# Altium schematic sheet IDC_connectors.SchDoc: IDC
size 420 x 297 mm; Author: G.K.; CompanyName: WUT; DrawnBy: G.K.; Organization: CERN; Address1: Warsaw Univeristy of Technology; Address2: Nowowiejska 15/19; DocumentNumber: 7; Revision: -; SheetNumber: 7; SheetTotal: 10; EDA_Number: ARTIQ; Projet: Banker; ModifiedBy: -; CreateDate: XX/XX/XXXX; CheckedDate: -; Title2: Connector & driver; DivGrp: ISE; Designer: G.K.; ModifiedDate: -; ProjectName: ADC/DAC MEZZANINE
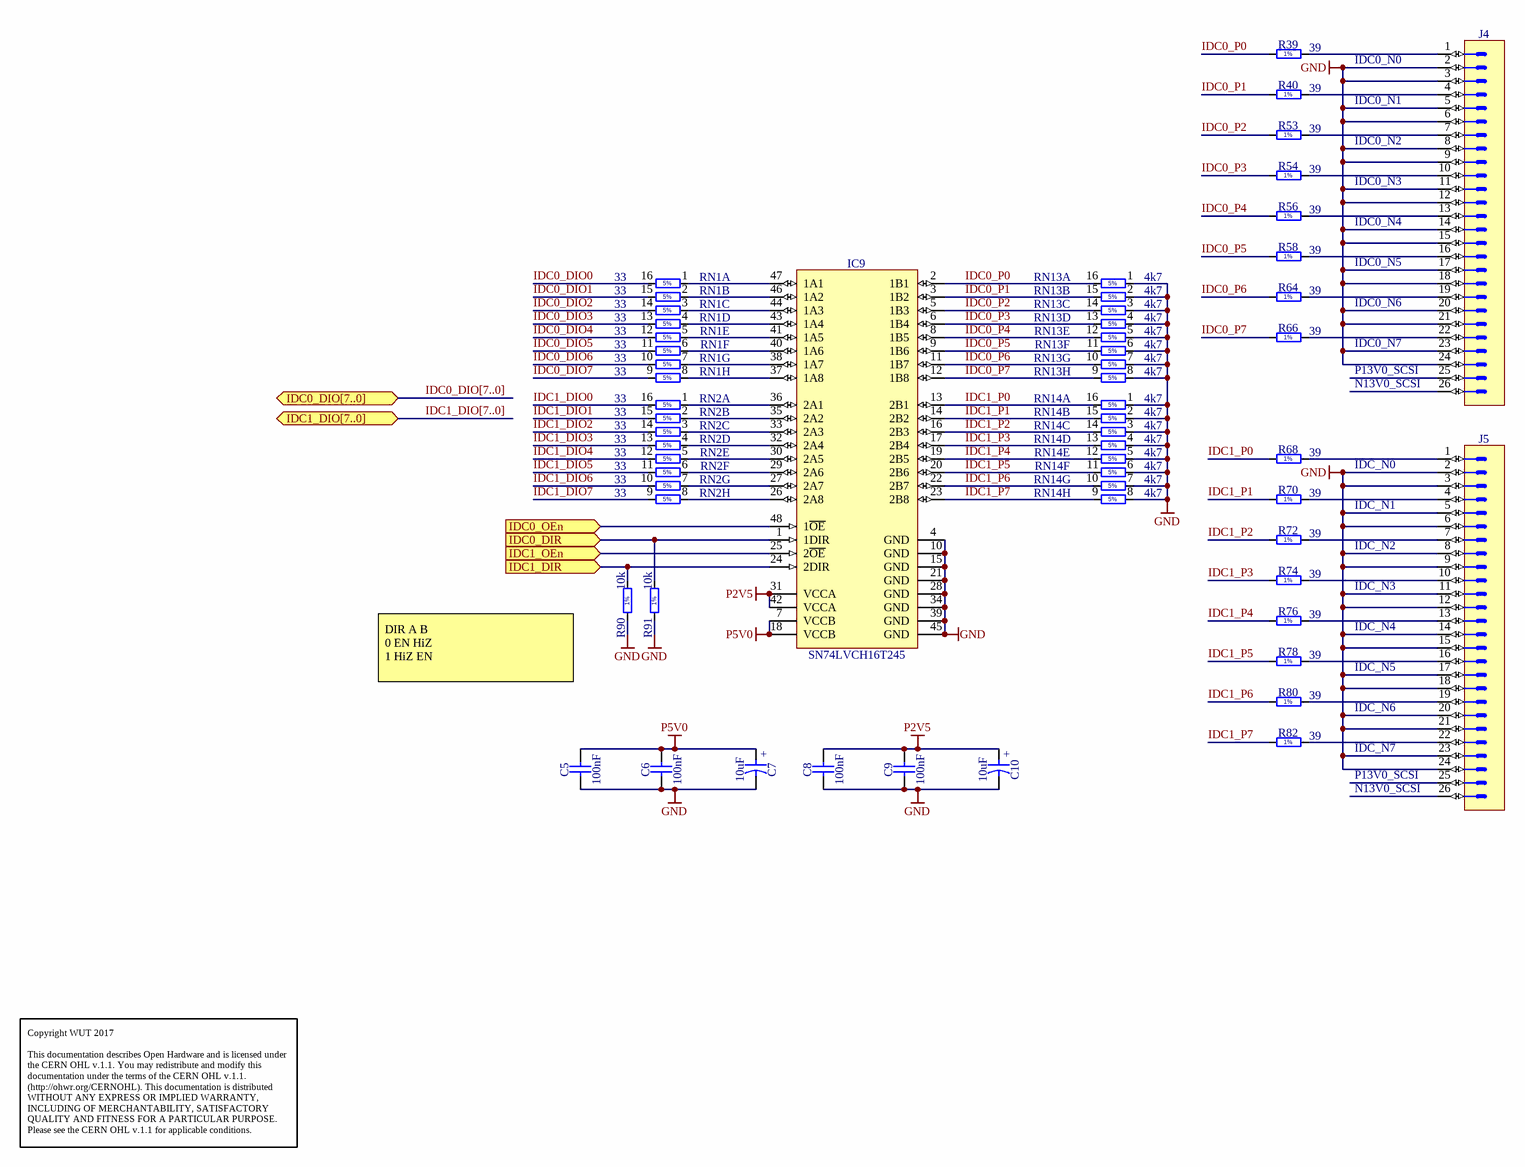
[diagram p0: IDC_connectors.SchDoc]

## Parts
C5  100nF  [CAPC1005X55N]
C6  100nF  [CAPC1005X55N]
C7  10uF  [CAPAE430X540N]
C8  100nF  [CAPC1005X55N]
C9  100nF  [CAPC1005X55N]
C10  10uF  [CAPAE430X540N]
IC9  SN74LVCH16T245  [SOP50P810X120-48N]
J4  Header 26  [3M_N2526-6003RB]  (value not drawn)
J5  Header 26  [3M_N2526-6003RB]  (value not drawn)
R39  39  [RESC2012X60N]
R40  39  [RESC2012X60N]
R53  39  [RESC2012X60N]
R54  39  [RESC2012X60N]
R56  39  [RESC2012X60N]
R58  39  [RESC2012X60N]
R64  39  [RESC2012X60N]
R66  39  [RESC2012X60N]
R68  39  [RESC2012X60N]
R70  39  [RESC2012X60N]
R72  39  [RESC2012X60N]
R74  39  [RESC2012X60N]
R76  39  [RESC2012X60N]
R78  39  [RESC2012X60N]
R80  39  [RESC2012X60N]
R82  39  [RESC2012X60N]
R90  10k  [RESC1005X40N]
R91  10k  [RESC1005X40N]
RN1  33  [RN_YAGEO_YC248]  (parts A,B,C,D,E,F,G,H of 8)
RN2  33  [RN_YAGEO_YC248]  (parts A,B,C,D,E,F,G,H of 8)
RN13  4k7  [RN_YAGEO_YC248]  (parts A,B,C,D,E,F,G,H of 8)
RN14  4k7  [RN_YAGEO_YC248]  (parts A,B,C,D,E,F,G,H of 8)

## Ports
IDC0_DIO[7..0] (bidir), IDC0_DIR (in), IDC0_OEn (in), IDC1_DIO[7..0] (bidir), IDC1_DIR (in), IDC1_OEn (in)

## Nets
GND: C5.1 C6.1 C7.2 C8.1 C9.1 C10.2 IC9.4(GND) IC9.10(GND) IC9.15(GND) IC9.21(GND) IC9.28(GND) IC9.34(GND) IC9.39(GND) IC9.45(GND) J4.2 J4.3 J4.5 J4.6 J4.8 J4.9 J4.11 J4.12 J4.14 J4.15 J4.17 J4.18 J4.20 J4.21 J4.23 J4.24 J5.2 J5.3 J5.5 J5.6 J5.8 J5.9 J5.11 J5.12 J5.14 J5.15 J5.17 J5.18 J5.20 J5.21 J5.23 J5.24 R90.1 R91.1 RN13.1 RN13.2 RN13.3 RN13.4 RN13.5 RN13.6 RN13.7 RN13.8 RN14.1 RN14.2 RN14.3 RN14.4 RN14.5 RN14.6 RN14.7 RN14.8
P2V5: C8.2 C9.2 C10.1 IC9.31(VCCA) IC9.42(VCCA)
P5V0: C5.2 C6.2 C7.1 IC9.7(VCCB) IC9.18(VCCB)
IDC0_DIO0: RN1.16
IDC0_DIO1: RN1.15
IDC0_DIO2: RN1.14
IDC0_DIO3: RN1.13
IDC0_DIO4: RN1.12
IDC0_DIO5: RN1.11
IDC0_DIO6: RN1.10
IDC0_DIO7: RN1.9
IDC0_DIR: IC9.1(1DIR) R91.2 ; port IDC0_DIR
IDC0_OEn: IC9.48(1~{OE}) ; port IDC0_OEn
IDC0_P0: IC9.2(1B1) R39.1 RN13.16
IDC0_P1: IC9.3(1B2) R40.1 RN13.15
IDC0_P2: IC9.5(1B3) R53.1 RN13.14
IDC0_P3: IC9.6(1B4) R54.1 RN13.13
IDC0_P4: IC9.8(1B5) R56.1 RN13.12
IDC0_P5: IC9.9(1B6) R58.1 RN13.11
IDC0_P6: IC9.11(1B7) R64.1 RN13.10
IDC0_P7: IC9.12(1B8) R66.1 RN13.9
IDC1_DIO0: RN2.16
IDC1_DIO1: RN2.15
IDC1_DIO2: RN2.14
IDC1_DIO3: RN2.13
IDC1_DIO4: RN2.12
IDC1_DIO5: RN2.11
IDC1_DIO6: RN2.10
IDC1_DIO7: RN2.9
IDC1_DIR: IC9.24(2DIR) R90.2 ; port IDC1_DIR
IDC1_OEn: IC9.25(2~{OE}) ; port IDC1_OEn
IDC1_P0: IC9.13(2B1) R68.1 RN14.16
IDC1_P1: IC9.14(2B2) R70.1 RN14.15
IDC1_P2: IC9.16(2B3) R72.1 RN14.14
IDC1_P3: IC9.17(2B4) R74.1 RN14.13
IDC1_P4: IC9.19(2B5) R76.1 RN14.12
IDC1_P5: IC9.20(2B6) R78.1 RN14.11
IDC1_P6: IC9.22(2B7) R80.1 RN14.10
IDC1_P7: IC9.23(2B8) R82.1 RN14.9
NetIC9_26: IC9.26(2A8) RN2.8
NetIC9_27: IC9.27(2A7) RN2.7
NetIC9_29: IC9.29(2A6) RN2.6
NetIC9_30: IC9.30(2A5) RN2.5
NetIC9_32: IC9.32(2A4) RN2.4
NetIC9_33: IC9.33(2A3) RN2.3
NetIC9_35: IC9.35(2A2) RN2.2
NetIC9_36: IC9.36(2A1) RN2.1
NetIC9_37: IC9.37(1A8) RN1.8
NetIC9_38: IC9.38(1A7) RN1.7
NetIC9_40: IC9.40(1A6) RN1.6
NetIC9_41: IC9.41(1A5) RN1.5
NetIC9_43: IC9.43(1A4) RN1.4
NetIC9_44: IC9.44(1A3) RN1.3
NetIC9_46: IC9.46(1A2) RN1.2
NetIC9_47: IC9.47(1A1) RN1.1
NetJ4_1: J4.1 R39.2
NetJ4_4: J4.4 R40.2
NetJ4_7: J4.7 R53.2
NetJ4_10: J4.10 R54.2
NetJ4_13: J4.13 R56.2
NetJ4_16: J4.16 R58.2
NetJ4_19: J4.19 R64.2
NetJ4_22: J4.22 R66.2
NetJ5_1: J5.1 R68.2
NetJ5_4: J5.4 R70.2
NetJ5_7: J5.7 R72.2
NetJ5_10: J5.10 R74.2
NetJ5_13: J5.13 R76.2
NetJ5_16: J5.16 R78.2
NetJ5_19: J5.19 R80.2
NetJ5_22: J5.22 R82.2

Not connected (* = marked no-connect by the designer): J4 25 26; J5 25 26

## Buses and harness runs
bus IDC0_DIO[7..0] = port IDC0_DIO[7..0]
bus IDC1_DIO[7..0] = port IDC1_DIO[7..0]

## Notes on the sheet
- IDC0_N0
- IDC0_N1
- IDC0_N2
- IDC0_N3
- IDC0_N4
- IDC0_N5
- IDC0_N6
- IDC0_N7
- P13V0_SCSI
- N13V0_SCSI
- IDC_N0
- IDC_N1
- IDC_N2
- IDC_N3
- DIR	A	B
  0	EN	HiZ
  1	HiZ	EN
- IDC_N4
- IDC_N5
- IDC_N6
- IDC_N7
- Copyright WUT 2017
  This documentation describes Open Hardware and is licensed under the CERN OHL v.1.1. You may redistribute and modify this documentation under the terms of the CERN OHL v.1.1. (http://ohwr.org/CERNOHL). This documentation is distributed WITHOUT ANY EXPRESS OR IMPLIED WARRANTY, INCLUDING OF MERCHANTABILITY, SATISFACTORY QUALITY AND FITNESS FOR A PARTICULAR PURPOSE. Please see the CERN OHL v.1.1 for applicable conditions.
- Project/Equipment
- Document
- Designer
- Drawn by
- Check.by
- File
- Last Mod.
- Print Date
- Sheet
- Size
- A3
- of
- Rev
- (in symbol CAE430-540_10UF_16V_20%) +
- (in symbol R0402_10K_1%_0.0625W_100PPM) 1%
- (in symbol R0805_39R_1%_0.125W_100PPM) 1%
- (in symbol RES_RN_4K7_YAGEO_YC248-JR-074K7L, part A) 5%
- (in symbol RES_RN_4K7_YAGEO_YC248-JR-074K7L, part B) 5%
- (in symbol RES_RN_4K7_YAGEO_YC248-JR-074K7L, part C) 5%
- (in symbol RES_RN_4K7_YAGEO_YC248-JR-074K7L, part D) 5%
- (in symbol RES_RN_4K7_YAGEO_YC248-JR-074K7L, part E) 5%
- (in symbol RES_RN_4K7_YAGEO_YC248-JR-074K7L, part F) 5%
- (in symbol RES_RN_4K7_YAGEO_YC248-JR-074K7L, part G) 5%
- (in symbol RES_RN_4K7_YAGEO_YC248-JR-074K7L, part H) 5%
- (in symbol RN_33R_YAGEO_YC248-JR-0733RL, part A) 5%
- (in symbol RN_33R_YAGEO_YC248-JR-0733RL, part B) 5%
- (in symbol RN_33R_YAGEO_YC248-JR-0733RL, part C) 5%
- (in symbol RN_33R_YAGEO_YC248-JR-0733RL, part D) 5%
- (in symbol RN_33R_YAGEO_YC248-JR-0733RL, part E) 5%
- (in symbol RN_33R_YAGEO_YC248-JR-0733RL, part F) 5%
- (in symbol RN_33R_YAGEO_YC248-JR-0733RL, part G) 5%
- (in symbol RN_33R_YAGEO_YC248-JR-0733RL, part H) 5%

## Library data of the parts
C5 C6 C8 C9 = CC0402_100NF_16V_10%_X5R: Non-polarised capacitor; Part Description: SMD Multilayer Chip Ceramic Capacitor; Manufacturer: GENERIC; Manufacturer1 Part Number: GRM155R61C104KA88D; Voltage: 16V; TC: X5R; Tolerance: ±10%; Part Number: CC0402_100NF_16V_10%_X5R; Component Kind: Standard; Component Type: Standard; Pin Count: 2; Value: 100nF; Status: None; Manufacturer Part Number: CC0402_100NF_16V_10%_X5R; Case: 0402; Mounted: Yes; Socket: No; SMD: Yes; Sense: No; Manufacturer1 Example: MURATA; Manufacturer1 ComponentHeight: 0.55mm; HelpURL: \\cern.ch\dfs\Applications\Altium\Datasheets\CC0402_X5R_MURATA_GRM.pdf; Author: CERN DEM JLC; CreateDate: 10.12.2013; LatestRevisionDate: 10.12.2013
C7 C10 = CAE430-540_10UF_16V_20%: Polarised capacitor; Part Description: Aluminum Electrolytic SMT Capacitor; Manufacturer: PANASONIC; Manufacturer Part Number: EEEFK1C100AR; Voltage: 16V; Tolerance: ±20%; Part Number: CAE430-540_10UF_16V_20%; Component Kind: Standard; Component Type: Standard; Pin Count: 2; Value: 10uF; Status: Not Recommended; Case: B; Mounted: Yes; Socket: No; SMD: Yes; Sense: No; ComponentHeight: 5.8mm; HelpURL: \\cern.ch\dfs\Applications\Altium\Datasheets\CAE_PANASONIC_FK.pdf; Author: CERN DEM JLC; CreateDate: 03.12.2007; LatestRevisionDate: 05.11.2014
IC9 = 74LVCH16T245: 16-Bit Dual-Supply Bus Transceiver With Configurable Voltage Translation And 3-State Outputs; Part Number: SN74LVCH16T245DGGR; Part Description: 16-Bit Dual-Supply Bus Transceivers With Configurable Voltage Translation And 3-State Outputs; Manufacturer: TEXAS INSTRUMENTS; PressFit: No; Bonding: No; Component Kind: Standard; Component Type: Standard; Device: SN74LVCH16T245; PackageDescription: SOP, 48-Leads, Body 12.6x6.2mm (max), Pitch 0.50mm, IPC Medium Density; Manufacturer Part Number: SN74LVCH16T245DGGR; Pin Count: 48; Case: TSSOP48; Mounted: Yes; Socket: No; SMD: Yes; Sense: No; ComponentHeight: 1.2mm; Author: GK; HelpURL: \\cern.ch\dfs\Applications\Altium\Datasheets\CLVCH16T245MDGGREP.pdf; CreateDate: 09/02/2016; LatestRevisionDate: 09/02/2016
J4 J5 = 3M_N2526-6003RB: Connector 26 Male; Part Description: 26 Contacts - Straight .100'' x .100'' Low Profile Four-Wall Header, 2500 Series; Manufacturer: 3M; PressFit: No; Part Number: 3M_N2526-6003RB; Component Kind: Standard; Component Type: Standard; Pin Count: 26; Family: Header 26; Mounted: Yes; Socket: No; SMD: No; Sense: No; Status: None; Manufacturer Part Number: N2526-6003RB; ComponentHeight: 9.91mm; HelpURL: \\cern.ch\dfs\Applications\Altium\Datasheets\3M_N2526-6003RB.pdf; Author: CERN DEM JLC; CreateDate: 22.01.2014; LatestRevisionDate: 22.01.2014
R39 R40 R53 R54 R56 R58 R64 R66 R68 R70 R72 R74 R76 R78 R80 R82 = R0805_39R_1%_0.125W_100PPM: Resistor - 1%; Part Description: General Purpose Thick Film Chip Resistor; Manufacturer: GENERIC; Manufacturer1 Part Number: NRC10F39R0TRF; Power: 0.125W; TC: ±100ppm/°C; PressFit: No; Part Number: R0805_39R_1%_0.125W_100PPM; Component Kind: Standard; Component Type: Standard; Pin Count: 2; Value: 39; Status: Preferred; Tolerance: ±1%; Manufacturer Part Number: R0805_39R_1%_0.125W_100PPM; Case: 0805; Mounted: Yes; Sense: No; Socket: No; SMD: Yes; Manufacturer1 Example: NIC COMPONENT; Manufacturer1 ComponentHeight: 0.6mm; HelpURL: \\cern.ch\dfs\Applications\Altium\Datasheets\R0805_NIC_NRC.pdf; Author: CERN DEM JLC; CreateDate: 03/12/2007; LatestRevisionDate: 13/03/2008
R90 R91 = R0402_10K_1%_0.0625W_100PPM: Resistor - 1%; Part Description: General Purpose Thick Film Chip Resistor; Manufacturer: GENERIC; Manufacturer1 Part Number: 232270671003L; TC: ±100ppm/°C; PressFit: No; Part Number: R0402_10K_1%_0.0625W_100PPM; Component Kind: Standard; Component Type: Standard; Pin Count: 2; Value: 10k; Status: Not Recommended; Power: 0.0625W; Tolerance: ±1%; Manufacturer Part Number: R0402_10K_1%_0.0625W_100PPM; Case: 0402; Mounted: Yes; Sense: No; Socket: No; SMD: Yes; Manufacturer1 Example: YAGEO PHYCOMP; Manufacturer1 ComponentHeight: 0.4mm; HelpURL: \\cern.ch\dfs\Applications\Altium\Datasheets\R0402_Phycomp_RC0402.pdf; Author: CERN DEM JLC; CreateDate: 03/12/2007; LatestRevisionDate: 17/10/2012
RN1 RN2 = RN_33R_YAGEO_YC248-JR-0733RL: DIL16 Resistor Network 8 Isolated Resistor 5%; Part Description: Chip Resistor Array , 8 Isolated Resistors (Side Convex Terminal), YC248 Series; Manufacturer: YAGEO; Power: 0.062W; PressFit: No; TC: ±200ppm/°C; Part Number: RN_33R_YAGEO_YC248-JR-0733RL; Component Kind: Standard; Component Type: Standard; Pin Count: 16; Value: 33; Sense: No; Tolerance: ±5%; Manufacturer Part Number: YC248-JR-0733RL; Mounted: Yes; Socket: No; SMD: Yes; ComponentHeight: 0.55mm; HelpURL: \\cern.ch\dfs\Applications\Altium\Datasheets\RN_YAGEO_YC248.pdf; Author: CERN DEM JLC; CreateDate: 13/01/2011; LatestRevisionDate: 13/01/2011
RN13 RN14 = RES_RN_4K7_YAGEO_YC248-JR-074K7L: 8x Resistor Network  Isolated Resistor 5%; Part Number: RN_33R_YAGEO_YC248-JR-074K7L; Part Description: Chip Resistor Array , 8 Isolated Resistors (Side Convex Terminal), YC248 Series; Manufacturer: YAGEO; Power: 0.062W; PressFit: No; TC: ±200ppm/°C; Component Kind: Standard; Component Type: Standard; Pin Count: 16; Value: 4k7; Sense: No; Tolerance: ±5%; Manufacturer Part Number: YC248-JR-074K7L; Mounted: Yes; Socket: No; SMD: Yes; ComponentHeight: 0.55mm; HelpURL: \\cern.ch\dfs\Applications\Altium\Datasheets\RN_YAGEO_YC248.pdf; Author: GK; CreateDate: 13/01/2011; LatestRevisionDate: 13/01/2011